# Altium schematic sheet 18F4520SCH - Copy.SchDoc
size A4
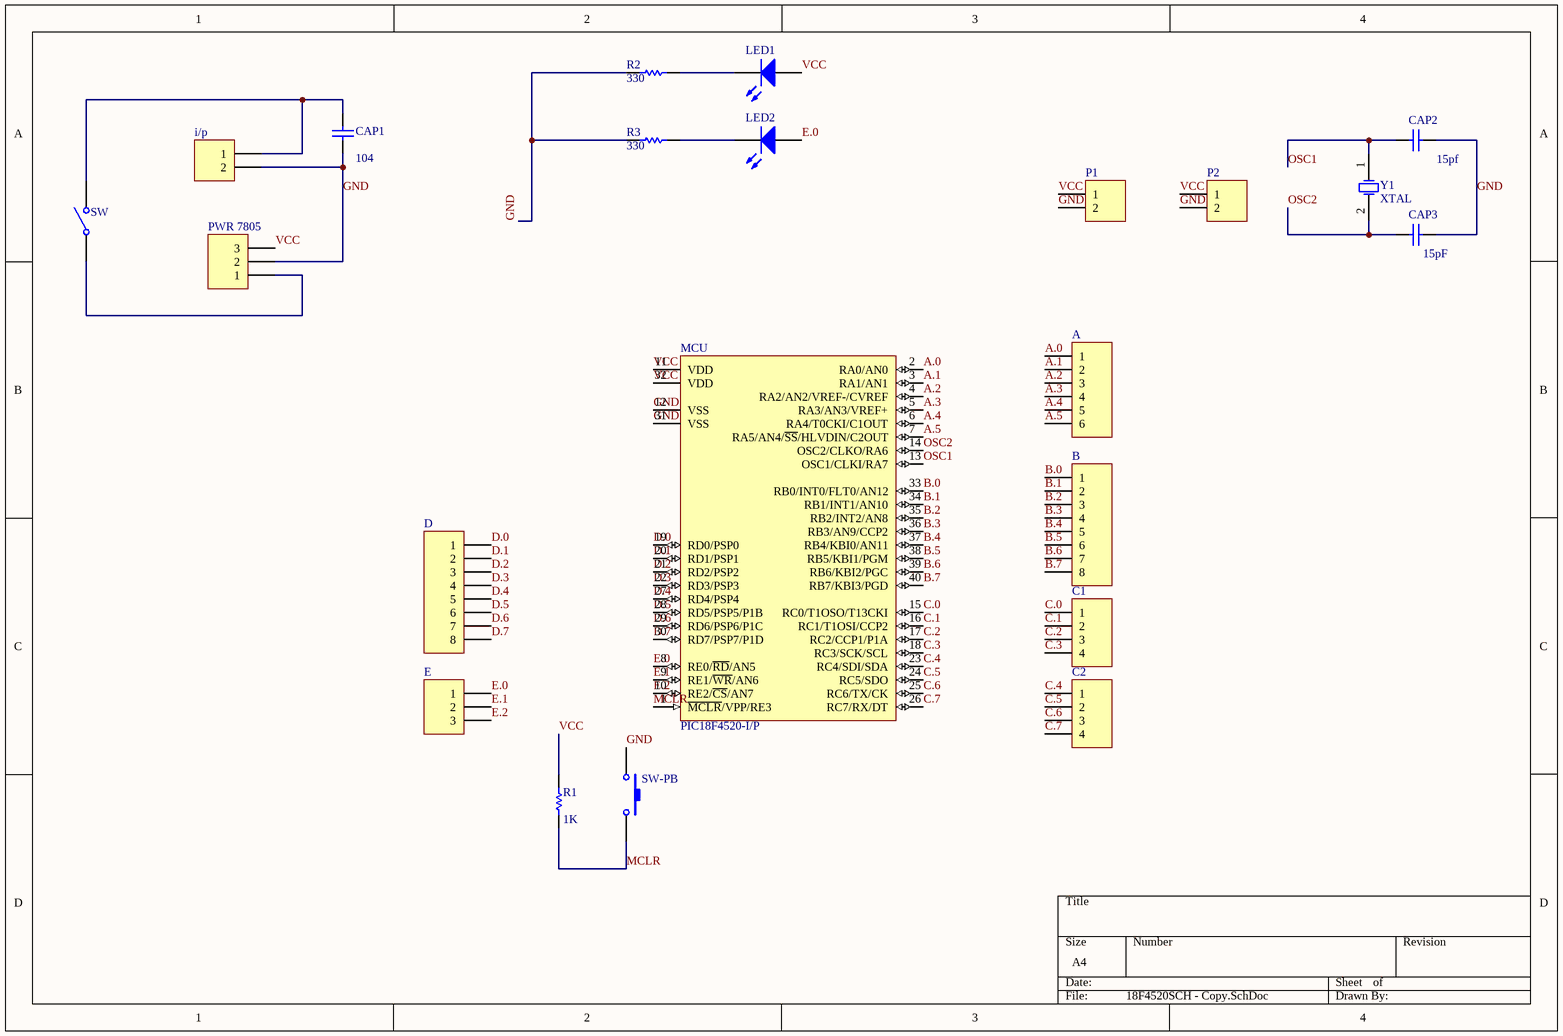
[diagram p0: 18F4520SCH - Copy.SchDoc]

## Parts
A  Header 6  [HDR1X6]  (value not drawn)
B  Header 8  [HDR1X8]  (value not drawn)
C1  Header 4  [HDR1X4]  (value not drawn)
C2  Header 4  [HDR1X4]  (value not drawn)
CAP1  value 104  [HDR1X2]  (hidden comment: Cap)
CAP2  value 15pf  [HDR1X2]  (hidden comment: Cap)
CAP3  value 15pF  [HDR1X2]  (hidden comment: Cap)
D  Header 8  [HDR1X8]  (value not drawn)
E  Header 3  [HDR1X3]  (value not drawn)
i/p  Header 2  [HDR1X2]  (value not drawn)
LED1  LED2  [HDR1X2]  (value not drawn)
LED2  LED2  [HDR1X2]  (value not drawn)
MCU  PIC18F4520-I/P  [PDIP600-P40]
P1  Header 2  [HDR1X2]  (value not drawn)
P2  Header 2  [HDR1X2]  (value not drawn)
PWR_7805  Header 3  [HDR1X3]  (value not drawn)
R1  value 1K  [AXIAL-0.3]  (hidden comment: Res1)
R2  value 330  [AXIAL-0.3]  (hidden comment: Res1)
R3  value 330  [AXIAL-0.3]  (hidden comment: Res1)
SW  SW-SPST  [SPST-2]  (value not drawn)
SW-PB  SW-PB  [SPST-2]  (value not drawn)
Y1  XTAL  [R38]

## Nets
A.0: A.1 MCU.2(RA0/AN0)
A.1: A.2 MCU.3(RA1/AN1)
A.2: A.3 MCU.4(RA2/AN2/VREF-/CVREF)
A.3: A.4 MCU.5(RA3/AN3/VREF+)
A.4: A.5 MCU.6(RA4/T0CKI/C1OUT)
A.5: A.6 MCU.7(RA5/AN4/~{SS}/HLVDIN/C2OUT)
B.0: B.1 MCU.33(RB0/INT0/FLT0/AN12)
B.1: B.2 MCU.34(RB1/INT1/AN10)
B.2: B.3 MCU.35(RB2/INT2/AN8)
B.3: B.4 MCU.36(RB3/AN9/CCP2)
B.4: B.5 MCU.37(RB4/KBI0/AN11)
B.5: B.6 MCU.38(RB5/KBI1/PGM)
B.6: B.7 MCU.39(RB6/KBI2/PGC)
B.7: B.8 MCU.40(RB7/KBI3/PGD)
C.0: C1.1 MCU.15(RC0/T1OSO/T13CKI)
C.1: C1.2 MCU.16(RC1/T1OSI/CCP2)
C.2: C1.3 MCU.17(RC2/CCP1/P1A)
C.3: C1.4 MCU.18(RC3/SCK/SCL)
C.4: C2.1 MCU.23(RC4/SDI/SDA)
C.5: C2.2 MCU.24(RC5/SDO)
C.6: C2.3 MCU.25(RC6/TX/CK)
C.7: C2.4 MCU.26(RC7/RX/DT)
D.0: D.1 MCU.19(RD0/PSP0)
D.1: D.2 MCU.20(RD1/PSP1)
D.2: D.3 MCU.21(RD2/PSP2)
D.3: D.4 MCU.22(RD3/PSP3)
D.4: D.5 MCU.27(RD4/PSP4)
D.5: D.6 MCU.28(RD5/PSP5/P1B)
D.6: D.7 MCU.29(RD6/PSP6/P1C)
D.7: D.8 MCU.30(RD7/PSP7/P1D)
E.0: E.1 LED2.1(A) MCU.8(RE0/~{RD}/AN5)
E.1: E.2 MCU.9(RE1/~{WR}/AN6)
E.2: E.3 MCU.10(RE2/~{CS}/AN7)
GND: CAP1.1 CAP2.2 CAP3.2 i/p.2 MCU.12(VSS) MCU.31(VSS) P1.2 P2.2 PWR_7805.2 R2.1 R3.1 SW-PB.1
MCLR: MCU.1(~{MCLR}/VPP/RE3) R1.1 SW-PB.2
OSC1: CAP2.1 MCU.13(OSC1/CLKI/RA7) Y1.1(OSC1)
OSC2: CAP3.1 MCU.14(OSC2/CLKO/RA6) Y1.2(OSC2)
VCC: LED1.1(A) MCU.11(VDD) MCU.32(VDD) P1.1 P2.1 PWR_7805.3 R1.2
NetCAP1_2: CAP1.2 i/p.1 SW.2(NO)
NetLED1_2: LED1.2(K) R2.2
NetLED2_2: LED2.2(K) R3.2
NetPWR_7805_1: PWR_7805.1 SW.1(COMMON)

## Library data of the parts
A = Header 6: Header, 6-Pin; LatestRevisionDate: 17-Jul-2002; LatestRevisionNote: Re-released for DXP Platform.; Publisher: Altium Limited
B D = Header 8: Header, 8-Pin; LatestRevisionDate: 17-Jul-2002; LatestRevisionNote: Re-released for DXP Platform.; Publisher: Altium Limited
C1 C2 = Header 4: Header, 4-Pin; LatestRevisionDate: 17-Jul-2002; LatestRevisionNote: Re-released for DXP Platform.; Publisher: Altium Limited
CAP1-CAP3 = Cap: Capacitor; Published: 8-Jun-2000; LatestRevisionDate: 17-Jul-2002; LatestRevisionNote: Re-released for DXP Platform.; PackageReference: RAD-0.3; Publisher: Altium Limited; PackageDescription: Radial Cap, Thru-Hole; 2 Leads; 0.3 in Pin Spacing
E PWR_7805 = Header 3: Header, 3-Pin; LatestRevisionDate: 17-Jul-2002; LatestRevisionNote: Re-released for DXP Platform.; Publisher: Altium Limited
i/p P1 P2 = Header 2: Header, 2-Pin; LatestRevisionDate: 17-Jul-2002; LatestRevisionNote: Re-released for DXP Platform.; Publisher: Altium Limited
LED1 LED2 = LED2: Typical RED, GREEN, YELLOW, AMBER GaAs LED; Published: 8-Jun-2000; LatestRevisionDate: 17-Jul-2002; LatestRevisionNote: Re-released for DXP Platform.; PackageVersion: Feb-2002; PackageReference: 3.2X1.6X1.1; Publisher: Altium Limited; PackageDescription: SM LED; 2 Flat Leads
MCU = PIC18F4520-I/P: Enhanced Flash Microcontroller with 10-Bit A/D and nanoWatt Technology, 32K Flash, 40-Pin PDIP, Industrial Temperature Range; Published: 29-Jan-2009; LatestRevisionDate: 02-Dec-2009; LatestRevisionNote: Updated to datasheet revision E, Oct-2008; DatasheetVersion: revE, Oct-2008; PackageVersion: revBB, Aug-2009; PackageReference: PDIP600-P40; Publisher: Altium Limited; PackageDescription: 40-Lead Plastic Dual In-Line (P) - 600 mil Body [PDIP]; Supplier 1: Digi-Key; Supplier Part Number 1: PIC18F4520-I/P-ND; Supplier 2: Farnell; Supplier Part Number 2: 1523812; Supplier 3: Farnell; Supplier Part Number 3: 1212702; ComponentLink1Description: Datasheet; ComponentLink1URL: http://ww1.microchip.com/downloads/en/DeviceDoc/39631E.pdf; ComponentLink2Description: Packaging Specification; ComponentLink2URL: http://www.microchip.com/stellent/groups/techpub_sg/documents/packagingspec/en012702.pdf; ComponentLink3Description: Microchip.com Home; ComponentLink3URL: http://www.microchip.com/
R1-R3 = Res1: Resistor; Published: 8-Jun-2000; LatestRevisionDate: 17-Jul-2002; LatestRevisionNote: Re-released for DXP Platform.; PackageReference: AXIAL-0.3; Publisher: Altium Limited; PackageDescription: Axial Device, Thru-Hole; 2 Leads; 0.3 in Pin Spacing
SW = SW-SPST: Single-Pole, Single-Throw Switch; Published: 24-Mar-1999; LatestRevisionDate: 17-Jul-2002; LatestRevisionNote: Re-released for DXP Platform.; PackageReference: SPST-2; Publisher: Altium Limited; PackageDescription: Switch; 2 Leads
SW-PB = SW-PB: Switch; Published: 24-Mar-1999; LatestRevisionDate: 17-Jul-2002; LatestRevisionNote: Re-released for DXP Platform.; PackageReference: SPST-2; Publisher: Altium Limited; PackageDescription: Switch; 2 Leads
Y1 = XTAL: Crystal Oscillator; Published: 8-Jun-2000; LatestRevisionDate: 17-Jul-2002; LatestRevisionNote: Re-released for DXP Platform.; PackageReference: R38; Publisher: Altium Limited; PackageDescription: Crystal, Thru-Hole; 2 Leads; Body 3.1 x 8.2 mm (Dia.xH)